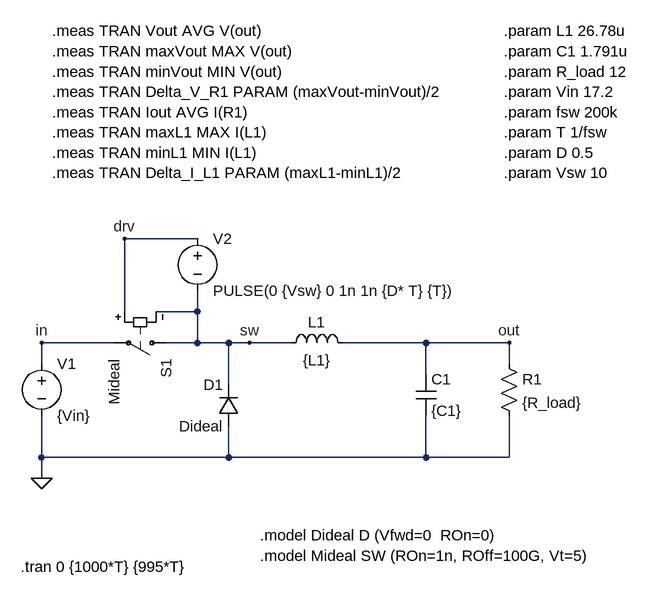
[diagram p0: schematic Draft2.asc]
Draft2.asc, the LTspice schematic file:
Version 4
SHEET 1 1040 680
WIRE 352 -32 240 -32
WIRE 240 80 240 -32
WIRE 352 80 352 48
WIRE 352 80 288 80
WIRE 224 128 112 128
WIRE 352 128 352 80
WIRE 352 128 304 128
WIRE 400 128 352 128
WIRE 432 128 400 128
WIRE 496 128 432 128
WIRE 704 128 576 128
WIRE 832 128 704 128
WIRE 112 160 112 128
WIRE 832 160 832 128
WIRE 704 176 704 128
WIRE 400 192 400 128
WIRE 112 304 112 240
WIRE 400 304 400 256
WIRE 400 304 112 304
WIRE 704 304 704 240
WIRE 704 304 400 304
WIRE 832 304 832 240
WIRE 832 304 704 304
WIRE 112 336 112 304
FLAG 112 336 0
FLAG 240 -32 drv
FLAG 432 128 sw
FLAG 832 128 out
FLAG 112 128 in
SYMBOL voltage 112 144 R0
SYMATTR InstName V1
SYMATTR Value {Vin}
SYMBOL res 816 144 R0
SYMATTR InstName R1
SYMATTR Value {R_load}
SYMBOL cap 688 176 R0
SYMATTR InstName C1
SYMATTR Value {C1}
SYMBOL ind 480 144 R270
WINDOW 0 32 56 VTop 2
WINDOW 3 5 56 VBottom 2
SYMATTR InstName L1
SYMATTR Value {L1}
SYMBOL diode 416 256 R180
WINDOW 0 24 64 Left 2
WINDOW 3 24 0 Left 2
SYMATTR InstName D1
SYMATTR Value Dideal
SYMBOL sw 320 128 R90
SYMATTR InstName S1
SYMATTR Value Mideal
SYMBOL voltage 352 -48 R0
WINDOW 123 0 0 Left 0
WINDOW 39 0 0 Left 0
SYMATTR InstName V2
SYMATTR Value PULSE(0 {Vsw} 0 1n 1n {D* T} {T})
TEXT 448 424 Left 2 !.model Dideal D (Vfwd=0  ROn=0)\n.model Mideal SW (ROn=1n, ROff=100G, Vt=5)
TEXT 824 -352 Left 2 !.param L1 26.78u\n.param C1 1.791u \n.param R_load 12\n.param Vin 17.2\n.param fsw 200k\n.param T 1/fsw\n.param D 0.5\n.param Vsw 10
TEXT 80 472 Left 2 !.tran 0 {1000*T} {995*T}
TEXT 128 -352 Left 2 !.meas TRAN Vout AVG V(out)\n.meas TRAN maxVout MAX V(out)\n.meas TRAN minVout MIN V(out)\n.meas TRAN Delta_V_R1 PARAM (maxVout-minVout)/2\n.meas TRAN Iout AVG I(R1)\n.meas TRAN maxL1 MAX I(L1)\n.meas TRAN minL1 MIN I(L1)\n.meas TRAN Delta_I_L1 PARAM (maxL1-minL1)/2

The netlist it stands for:
* Draft2.asc
V1 in 0 {Vin}
R1 out 0 {R_load}
C1 out 0 {C1}
L1 sw out {L1}
D1 0 sw Dideal
S1 sw in drv sw Mideal
V2 drv sw PULSE(0 {Vsw} 0 1n 1n {D* T} {T})
.model D D
.lib standard.dio
.model Dideal D (Vfwd=0  ROn=0)
.model Mideal SW (ROn=1n, ROff=100G, Vt=5)
.param L1 26.78u
.param C1 1.791u
.param R_load 12
.param Vin 17.2
.param fsw 200k
.param T 1/fsw
.param D 0.5
.param Vsw 10
.tran 0 {1000*T} {995*T}
.meas TRAN Vout AVG V(out)
.meas TRAN maxVout MAX V(out)
.meas TRAN minVout MIN V(out)
.meas TRAN Delta_V_R1 PARAM (maxVout-minVout)/2
.meas TRAN Iout AVG I(R1)
.meas TRAN maxL1 MAX I(L1)
.meas TRAN minL1 MIN I(L1)
.meas TRAN Delta_I_L1 PARAM (maxL1-minL1)/2
.backanno
.end